# Altium schematic sheet 433Mhz Remote Receiver.SchDoc
size 297 x 209 mm; SheetNumber: 6; SheetTotal: 12
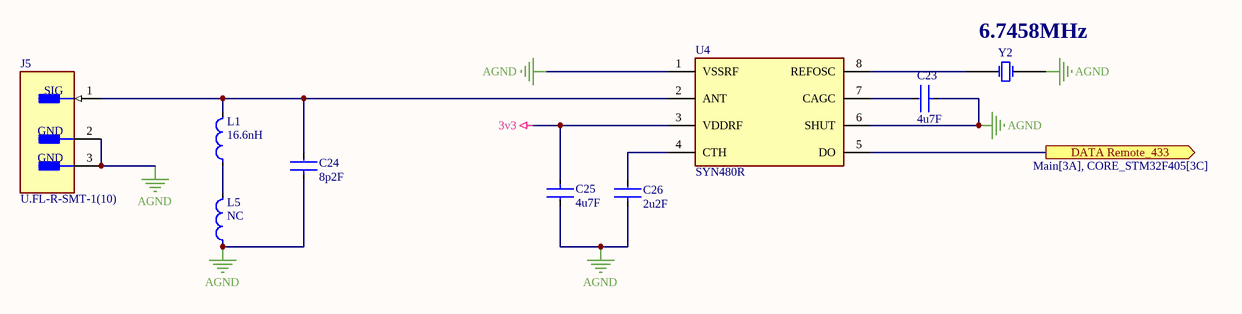
[diagram p0: 433Mhz Remote Receiver.SchDoc]

## Parts
C23  4u7F  [CAP-0603]
C24  8p2F  [CAP-0603]
C25  4u7F  [CAP-0603]
C26  2u2F  [CAP-0603]
J5  U.FL-R-SMT-1(10)  [Hirose U.FL_SMT-1_10-MFG]
L1  16.6nH  [ind-0603-MFG]
L5  NC  [ind-0603-MFG]
U4  SYN480R  [SOP8]
Y2  6.7458MHz  [CRYSTAL Small]

## Ports
DATA Remote_433 (out, see Main[3A], CORE_STM32F405[3C])

## Nets
3v3: C25.1 U4.3(VDDRF)
AGND: C23.1 C24.1 C25.2 C26.1 J5.2(GND) J5.3(GND) L5.1 U4.1(VSSRF) U4.6(SHUT) Y2.2(OSC2)
DATA Remote_433: U4.5(DO) ; port DATA Remote_433
NetC23_2: C23.2 U4.7(CAGC)
NetC24_2: C24.2 J5.1(SIG) L1.2 U4.2(ANT)
NetC26_2: C26.2 U4.4(CTH)
NetL1_1: L1.1 L5.2
NetU4_8: U4.8(REFOSC) Y2.1(OSC1)

## Notes on the sheet
- Title
- Size:
- Date:
- A4
- Variant :
- Time:
- Sheet
- Revision:
- of
- Company Link :
- Designer:
- Designer Link:
- www.fatehscan.com
- File:

## Library data of the parts
C23-C26 = CAP-Ceramic: Chip Multilayer Ceramic Capacitors for General Purpose, 0603; Voltage Rating (DC): 6.3V; Dielectric: X5R; Tolerance: 20%; Packaging: Tape and Reel; Width: 0.031inch; Termination: SMD/SMT; Package Quantity: 4000; Voltage Rating: 6.3V; Case/Package: 0603; Min Operating Temperature: -55°C; Voltage: 6.3V; Length: 1.6mm; Thickness: 0.035inch; Lead Free: Lead Free; Depth: 0.8mm; Case Code (Imperial): 0603; Max Operating Temperature: 85°C; Material: Ceramic; Height: 0.8mm; Mount: Surface Mount; REACH SVHC: No SVHC; Radiation Hardening: No; Case Code (Metric): 1608
  C23 C25: Capacitance: 4u7F
  C24: Capacitance: 8p2F
  C26: Capacitance: 2u2F
J5 = Hirose U.FL: CONN U.FL RCPT STR 50 OHM SMD / RF connector for high-frequency signals up to 6 GHz; Max Frequency: 6GHz; Connector Type: Coaxial; Body Plating: Silver; Body Material: Bronze; Impedance: 50R; Dielectric Material: Polymer; Insulation Resistance: 500MR; Gender: Male; Packaging: Cut Tape; Length: 3mm; Package Quantity: 2500; Termination: Solder; Lead Free: Lead Free; Series: U.FL; Min Operating Temperature: -40°C; Fastening Type: Snap; Contact Material: Brass; Orientation: Straight; Wire/Cable Type: Coaxial; Frequency: 6GHz; Contact Plating: Gold; Depth: 3.1mm; Weight: 0.001764oz; Max Operating Temperature: 90°C; Radiation Hardening: No; REACH SVHC: No SVHC; Mount: Surface Mount; Housing Color: Beige
L1 L5 = inductor: DC Current: 900mA; Core Material: Air; Case/Package: 0402
  L1: Value: 16.6nH
  L5: Value: NC
U4 = SYN480R: single chip ASK/OOK (ON-OFF Keyed) RF receiver IC. 300MHz to 450MHz frequency range
Y2 = XTAL_Crystal: XTAL Crystal; Designer: ABBAS BASEREH; Design Date: 2017-1-3; ComponentLink1Description: Datasheet; ComponentLink2Description: Reference; Mounting Technology: Surface Mount\Through-Hole; Value: 6.7458MHz; Status: Unreleased